# Altium project microwave_control_panel.PrjPcb
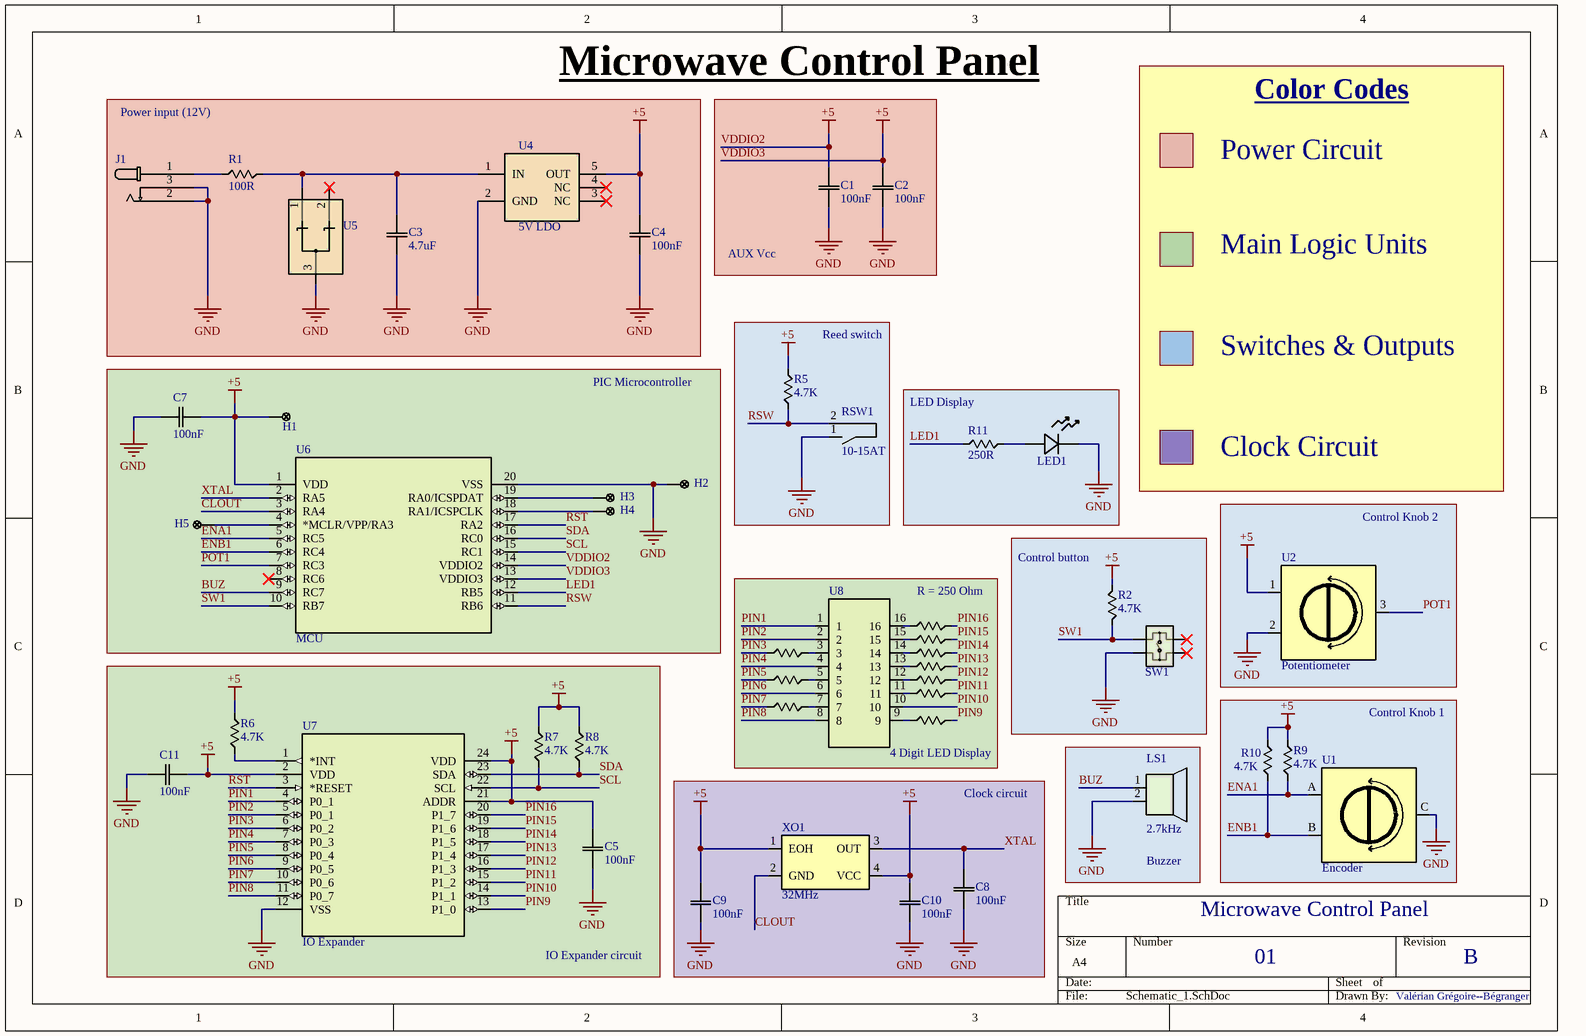
[diagram p0: Schematic_1.SchDoc]
1 sheet, 47 parts. Net scope: global (net labels, ports and power ports of the same name join across sheets).
Board file: PCB_1.PcbDoc

## Sheet Schematic_1.SchDoc
size A4; SheetNumber: 1; SheetTotal: 1

### Parts
C1  100nF  [0805_AVX]
C2  100nF  [0805_AVX]
C3  4.7uF  [CAP_08051A0R8CAT2A_AVX]
C4  100nF  [0805_AVX]
C5  100nF  [0805_AVX]
C7  100nF  [0805_AVX]
C8  100nF  [0805_AVX]
C9  100nF  [0805_AVX]
C10  100nF  [0805_AVX]
C11  100nF  [0805_AVX]
H1  Output  [1 pin header]  (value not drawn)
H2  Output  [1 pin header]  (value not drawn)
H3  Output  [1 pin header]  (value not drawn)
H4  Output  [1 pin header]  (value not drawn)
H5  Output  [1 pin header]  (value not drawn)
J1  PJ-002A  [PJ-002A_CUD]  (value not drawn)
LED1  156120VS75300  [LED_VS75300_WRE]  (value not drawn)
LS1  2.7kHz  [CMI-9605IC_CUD]
R1  100R  [0805_VIS]
R2  4.7K  [RES_1220_SUS]
R3  250R  [0805_VIS]  (value not drawn)
R4  250R  [0805_VIS]  (value not drawn)
R5  4.7K  [RES_1220_SUS]
R6  4.7K  [RES_1220_SUS]
R7  4.7K  [RES_1220_SUS]
R8  4.7K  [RES_1220_SUS]
R9  4.7K  [RES_1220_SUS]
R10  4.7K  [RES_1220_SUS]
R11  250R  [0805_VIS]
R12  250R  [0805_VIS]  (value not drawn)
R13  250R  [0805_VIS]  (value not drawn)
R14  250R  [0805_VIS]  (value not drawn)
R15  250R  [0805_VIS]  (value not drawn)
R16  250R  [0805_VIS]  (value not drawn)
R17  250R  [0805_VIS]  (value not drawn)
R18  250R  [0805_VIS]  (value not drawn)
R19  250R  [0805_VIS]  (value not drawn)
RSW1  10-15AT  [GP56010-15]
SW1  TS02-66-160-BK-100-LCR-D  [TS02-66-160-BK-100-LCR-D]  (value not drawn)
U1  Encoder  [288T232R161A1]
U2  Potentiometer  [2002111655]
U4  5V LDO  [SOT-23-5-DBV_TEX]
U5  MMBZ16VAT-QR  [SOT_SM712]  (value not drawn)
U6  MCU  [SOIC20_SO_MCH]
U7  IO Expander  [TSSOP24_4P5X7P9_NXP]
U8  LED Display  [TDCG1060M_VIS]  (value not drawn)
XO1  32MHz  [CB3-3C-64M0000]

### Blocks framed on the sheet
Microwave Control Panel: C3 C4 J1 R1 U4 U5
AUX Vcc: C1 C2
Reed switch: R5 RSW1
PIC Microcontroller: C7 H1-H5 U6
LED Display: LED1 R11
Control Knob 2: U2
Control button: R2 SW1
IO Expander circuit: C5 C11 R6-R8 U7
Control Knob 1: R9 R10 U1
Clock circuit: C8-C10 XO1
Buzzer: LS1

### Nets
GND: C1.1 C2.1 C3.1 C4.1 C5.1 C7.1 C8.1 C9.1 C10.1 C11.1 H2.1 J1.2 J1.3 LED1.1 LS1.2 RSW1.1 SW1.2 U1.C U2.2 U4.2(GND) U5.3 U6.20(VSS) U7.12(VSS)
VDDIO2: C1.2 C2.2 C4.2 C5.2 C7.2 C9.2 C10.2 C11.2 H1.1 R2.2 R5.2 R6.2 R7.2 R8.2 R9.2 R10.2 U2.1 U4.5(OUT) U6.1(VDD) U6.13(VDDIO3) U6.14(VDDIO2) U7.2(VDD) U7.21(ADDR) U7.24(VDD) XO1.1(EOH) XO1.4(VCC)  [also labelled +5, VDDIO3]
BUZ: LS1.1 U6.9(RC7)
CLOUT: U6.3(RA4) XO1.2(GND)
ENA1: R9.1 U1.A U6.5(RC5)
ENB1: R10.1 U1.B U6.6(RC4)
LED1: R11.1 U6.12(RB5)
PIN1: U7.4(P0_1) U8.1
PIN2: U7.5(P0_1) U8.2
PIN3: R12.1 U7.6(P0_2)
PIN4: U7.7(P0_3) U8.4
PIN5: R15.1 U7.8(P0_4)
PIN6: U7.9(P0_5) U8.6
PIN7: R18.1 U7.10(P0_6)
PIN8: U7.11(P0_7) U8.8
PIN9: R19.2 U7.13(P1_0)
PIN10: U7.14(P1_1) U8.10
PIN11: R17.2 U7.15(P1_2)
PIN12: R16.2 U7.16(P1_3)
PIN13: R14.2 U7.17(P1_4)
PIN14: R13.2 U7.18(P1_5)
PIN15: R4.2 U7.19(P1_6)
PIN16: R3.2 U7.20(P1_7)
POT1: U2.3 U6.7(RC3)
RST: U6.17(RA2) U7.3(*RESET)
RSW: R5.1 RSW1.2 U6.11(RB6)
SCL: R7.1 U6.15(RC1) U7.22(SCL)
SDA: R8.1 U6.16(RC0) U7.23(SDA)
SW1: R2.1 SW1.1 U6.10(RB7)
XTAL: C8.2 U6.2(RA5) XO1.3(OUT)
NetC3_2: C3.2 R1.2 U4.1(IN) U5.1
NetH3_1: H3.1 U6.19(RA0/ICSPDAT)
NetH4_1: H4.1 U6.18(RA1/ICSPCLK)
NetH5_1: H5.1 U6.4(*MCLR/VPP/RA3)
NetJ1_1: J1.1 R1.1
NetLED1_2: LED1.2 R11.2
NetR3_1: R3.1 U8.16
NetR4_1: R4.1 U8.15
NetR6_1: R6.1 U7.1(*INT)
NetR12_2: R12.2 U8.3
NetR13_1: R13.1 U8.14
NetR14_1: R14.1 U8.13
NetR15_2: R15.2 U8.5
NetR16_1: R16.1 U8.12
NetR17_1: R17.1 U8.11
NetR18_2: R18.2 U8.7
NetR19_1: R19.1 U8.9

Not connected (* = marked no-connect by the designer): U4 3(NC)* 4(NC)*; U5 2*; U6 8(RC6)*

### Notes on the sheet
- Power input (12V)
- Color Codes
- Power Circuit
- Main Logic Units
- Switches & Outputs
- Clock Circuit
- R = 250 Ohm
- 4 Digit LED Display
- Microwave Control Panel
- 01
- B
- Valérian Grégoire--Bégranger

### Library data of the parts
C1 C2 C4 C5 C7-C11 = 08051C103JAT2A: Mfr_Name: KYOCERA AVX
C3 = 08053C472K4Z2A: Mfr_Name: KYOCERA AVX
H1-H5 = 1 pin header
J1 = PJ-002A: DC power plug; Mfr_Name: CUI Devices; RefDes: RefDes; Type: Type
LED1 = 156120VS75300: LED; Mfr_Name: Wurth Electronics
LS1 = CMI-9605IC-0380T: Buzzer; Mfr_Name: CUI Devices; RefDes: RefDes; Type: Type
R1 = RCG080510R0FKEA: Mfr_Name: Vishay
R2 R5-R10 = RG2012P-472-B-T5: Mfr_Name: Susumu
R3 R4 R11-R19 = RNCF0805TKY250R: Mfr_Name: Vishay
RSW1 = GP56010-15: Reed switch
SW1 = TS02-66-160-BK-100-LCR-D: Push button
U1 = 288T232R161A1: 2b Encoder
U2 = 2002111655
U4 = TPS7B92050DBVR: Mfr_Name: Texas Instruments; RefDes: RefDes; Type: Type
U5 = MMBZ16VAT-QR: 13V TVS; Mfr_Name: Bourns Electronics; RefDes: RefDes; Type: Type
U6 = PIC18F15Q20T-ISO: PIC MCU; Mfr_Name: Microchip; RefDes: RefDes; Type: Type
U7 = PCAL6416APW: 16 I/O expander; Mfr_Name: NXP; RefDes: RefDes; Type: Type
U8 = TDCR1060M: 4 digit LED display; Mfr_Name: Vishay; RefDes: RefDes; Type: Type
XO1 = FO7HHADM320-T1: 32MHz Clock